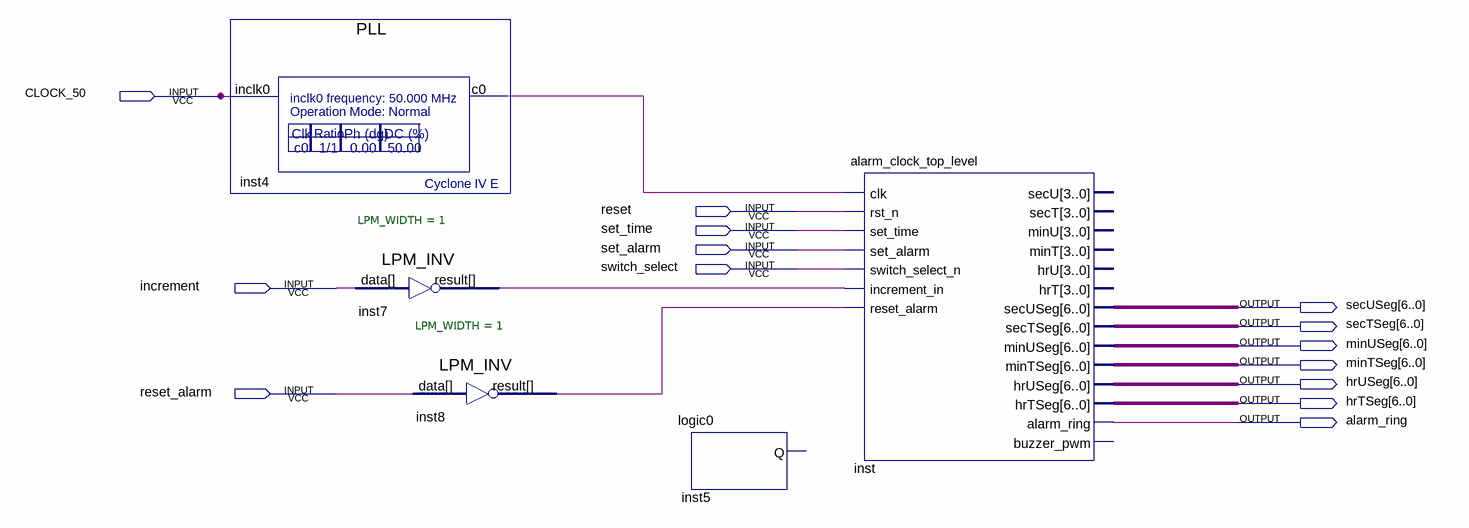
[diagram p0: schematic sheet]
// Quartus schematic AlarmClock.bdf as structural Verilog: 5 symbols, 14 pins
module AlarmClock (
  input  CLOCK_50,
  input  reset,
  input  set_time,
  input  set_alarm,
  input  switch_select,
  input  increment,
  input  reset_alarm,
  output [6:0] secUSeg,
  output [6:0] secTSeg,
  output [6:0] minUSeg,
  output [6:0] minTSeg,
  output [6:0] hrUSeg,
  output [6:0] hrTSeg,
  output alarm_ring
);

  wire inst4_c0, inst7_result, inst8_result;

  PLL inst4 (.inclk0(CLOCK_50), .c0(inst4_c0));
  LPM_INV #(.LPM_WIDTH(1)) inst7 (.data(increment), .result(inst7_result));
  LPM_INV #(.LPM_WIDTH(1)) inst8 (.data(reset_alarm), .result(inst8_result));
  logic0 inst5 ();  // open: Q
  alarm_clock_top_level inst (
    .clk(inst4_c0), .rst_n(reset), .set_time(set_time), .set_alarm(set_alarm),
    .switch_select_n(switch_select), .increment_in(inst7_result), .reset_alarm(inst8_result),
    .secUSeg(secUSeg), .secTSeg(secTSeg), .minUSeg(minUSeg), .minTSeg(minTSeg), .hrUSeg(hrUSeg),
    .hrTSeg(hrTSeg), .alarm_ring(alarm_ring));  // open: secU, secT, minU, minT, hrU, hrT, buzzer_pwm
endmodule
